# EAGLE schematic ioboard (EAGLE 9.6.2)
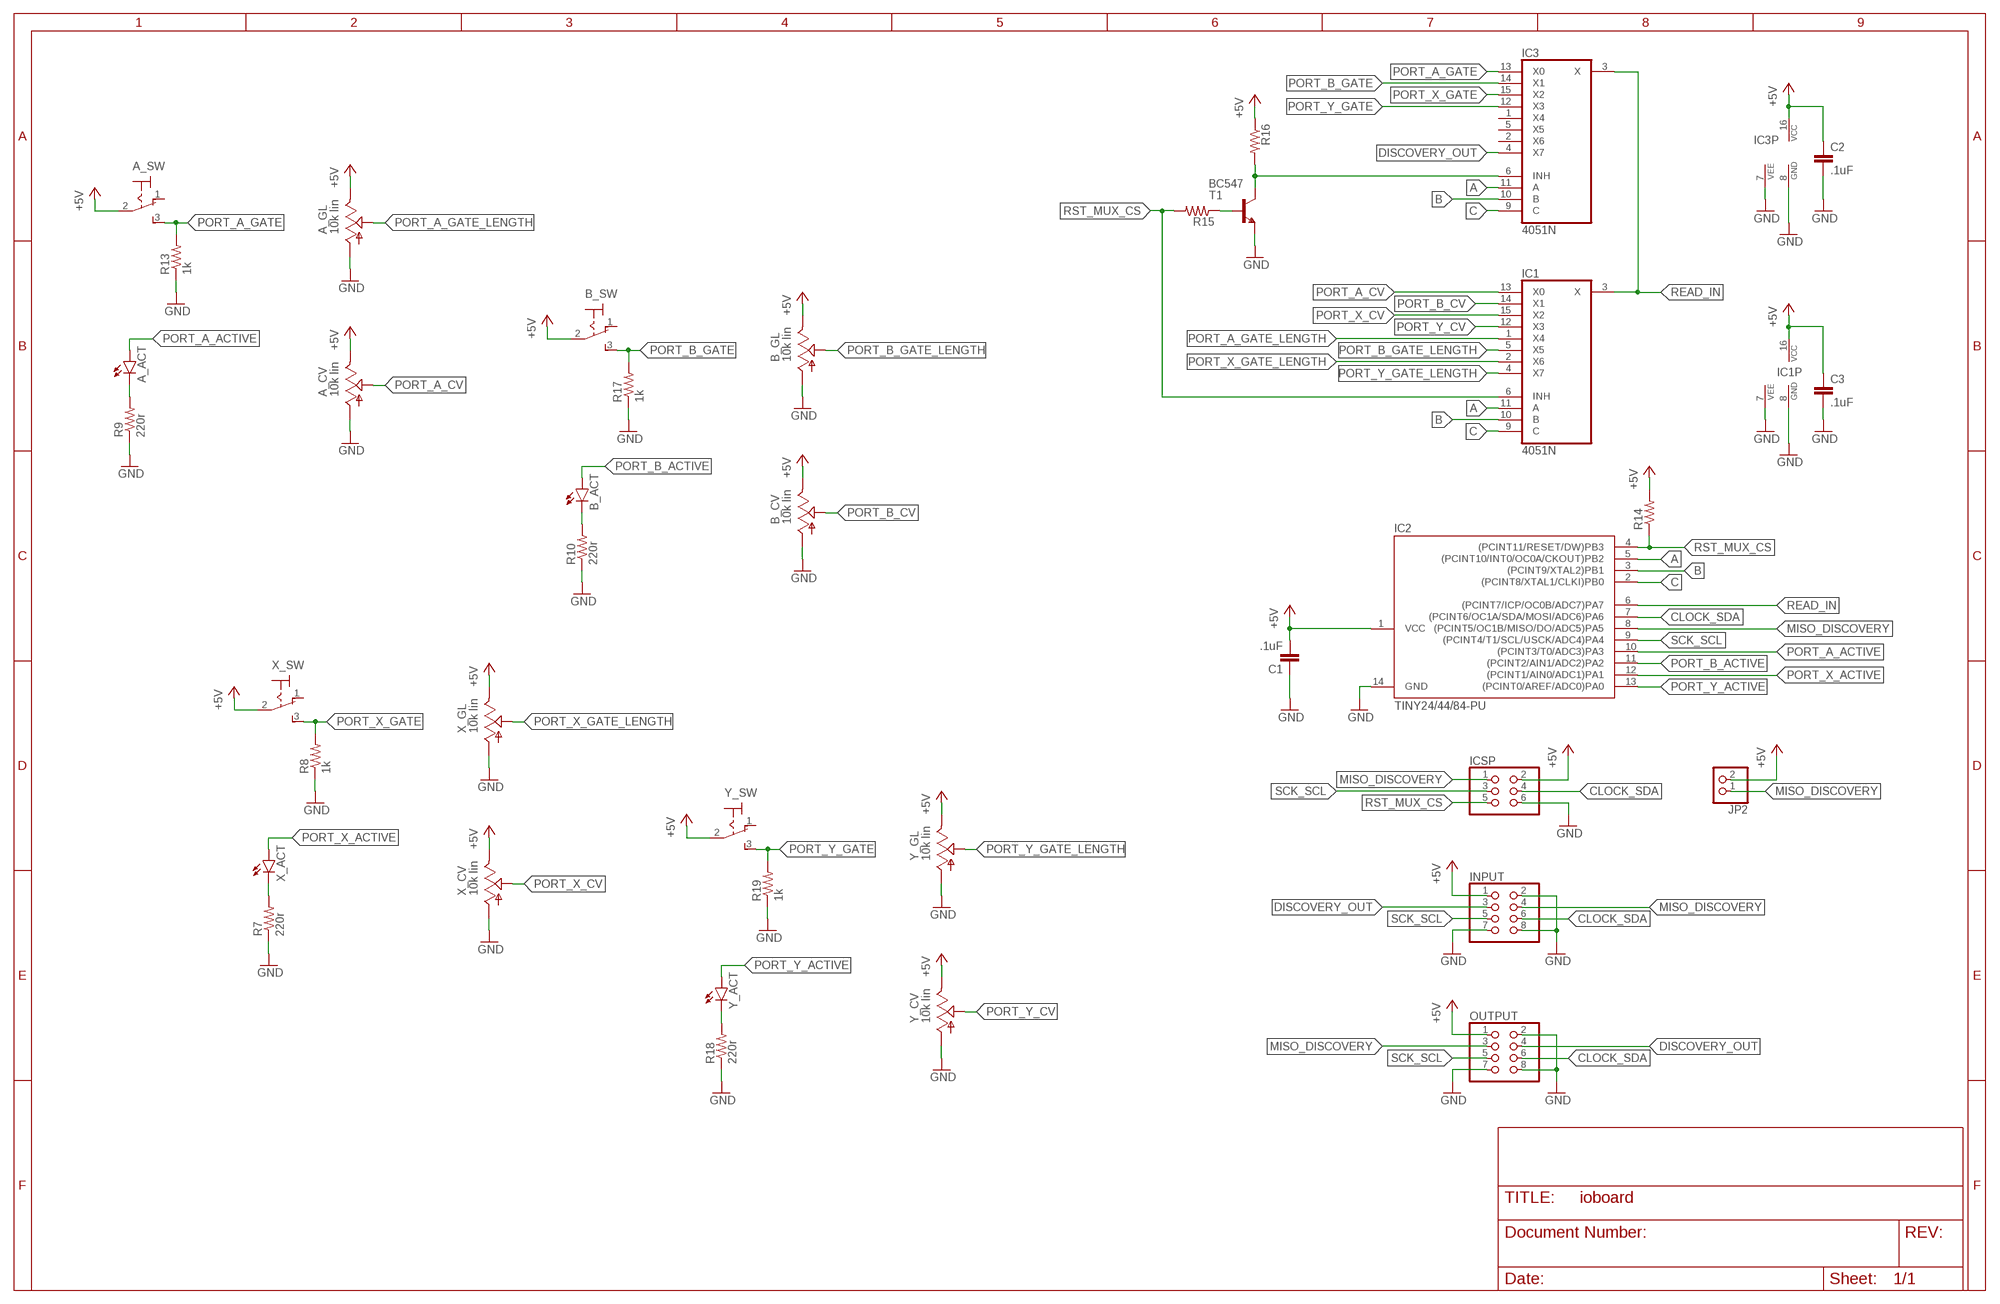
[diagram p0: schematic, sheet 1]

## Parts
A_ACT  LED5MM  [LED5MM]
A_CV  10k lin  ALPHA-9MMA  [EVUF]
A_GL  10k lin  ALPHA-9MMA  [EVUF]
A_SW  M9040P  [M9040P]
B_ACT  LED5MM  [LED5MM]
B_CV  10k lin  ALPHA-9MMA  [EVUF]
B_GL  10k lin  ALPHA-9MMA  [EVUF]
B_SW  M9040P  [M9040P]
C1  .1uF  C-EU050-024X044  [C050-024X044]
C2  .1uF  C-EU050-024X044  [C050-024X044]
C3  .1uF  C-EU050-024X044  [C050-024X044]
IC1  4051N  [DIL16]
IC2  TINY24/44/84-PU  [DIL14]
IC3  4051N  [DIL16]
ICSP  PINHD-2X3  [2X03]
INPUT  PINHD-2X4  [2X04]
JP2  PINHD-1X2  [1X02]
OUTPUT  PINHD-2X4  [2X04]
R7  220r  R-US_0204/7  [0204/7]
R8  1k  R-US_0204/7  [0204/7]
R9  220r  R-US_0204/7  [0204/7]
R10  220r  R-US_0204/7  [0204/7]
R13  1k  R-US_0204/7  [0204/7]
R14  R-US_0204/7  [0204/7]
R15  R-US_0204/7  [0204/7]
R16  R-US_0204/7  [0204/7]
R17  1k  R-US_0204/7  [0204/7]
R18  220r  R-US_0204/7  [0204/7]
R19  1k  R-US_0204/7  [0204/7]
T1  BC547  [TO92]
X_ACT  LED5MM  [LED5MM]
X_CV  10k lin  ALPHA-9MMA  [EVUF]
X_GL  10k lin  ALPHA-9MMA  [EVUF]
X_SW  M9040P  [M9040P]
Y_ACT  LED5MM  [LED5MM]
Y_CV  10k lin  ALPHA-9MMA  [EVUF]
Y_GL  10k lin  ALPHA-9MMA  [EVUF]
Y_SW  M9040P  [M9040P]

## Nets
+5V: A_CV.3(E) A_GL.3(E) A_SW.2(P) B_CV.3(E) B_GL.3(E) B_SW.2(P) C1.2 C2.1 C3.1 IC1.16(VCC) IC2.1(VCC) IC3.16(VCC) ICSP.2 INPUT.1 JP2.2 OUTPUT.1 R14.2 R16.1 X_CV.3(E) X_GL.3(E) X_SW.2(P) Y_CV.3(E) Y_GL.3(E) Y_SW.2(P)
A: IC1.11(A) IC2.5((PCINT10/INT0/OC0A/CKOUT)PB2) IC3.11(A)
B: IC1.10(B) IC2.3((PCINT9/XTAL2)PB1) IC3.10(B)
C: IC1.9(C) IC2.2((PCINT8/XTAL1/CLKI)PB0) IC3.9(C)
CLOCK_SDA: IC2.7((PCINT6/OC1A/SDA/MOSI/ADC6)PA6) ICSP.4 INPUT.6 OUTPUT.6
DISCOVERY_OUT: IC3.4(X7) INPUT.3 OUTPUT.4
GND: A_CV.1(A) A_GL.1(A) B_CV.1(A) B_GL.1(A) C1.1 C2.2 C3.2 IC1.7(VEE) IC1.8(GND) IC2.14(GND) IC3.7(VEE) IC3.8(GND) ICSP.6 INPUT.2 INPUT.7 INPUT.8 OUTPUT.2 OUTPUT.7 OUTPUT.8 R7.1 R8.1 R9.1 R10.1 R13.1 R17.1 R18.1 R19.1 T1.1(E) X_CV.1(A) X_GL.1(A) Y_CV.1(A) Y_GL.1(A)
MISO_DISCOVERY: IC2.8((PCINT5/OC1B/MISO/DO/ADC5)PA5) ICSP.1 INPUT.4 JP2.1 OUTPUT.3
N$1: A_ACT.K(C) R9.2
N$2: B_ACT.K(C) R10.2
N$3: R15.1 T1.2(B)
N$4: R7.2 X_ACT.K(C)
N$5: R18.2 Y_ACT.K(C)
N$7: IC3.6(INH) R16.2 T1.3(C)
PORT_A_ACTIVE: A_ACT.A IC2.10((PCINT3/T0/ADC3)PA3)
PORT_A_CV: A_CV.2(S) IC1.13(X0)
PORT_A_GATE: A_SW.3(S) IC3.13(X0) R13.2
PORT_A_GATE_LENGTH: A_GL.2(S) IC1.1(X4)
PORT_B_ACTIVE: B_ACT.A IC2.11((PCINT2/AIN1/ADC2)PA2)
PORT_B_CV: B_CV.2(S) IC1.14(X1)
PORT_B_GATE: B_SW.3(S) IC3.14(X1) R17.2
PORT_B_GATE_LENGTH: B_GL.2(S) IC1.5(X5)
PORT_X_ACTIVE: IC2.12((PCINT1/AIN0/ADC1)PA1) X_ACT.A
PORT_X_CV: IC1.15(X2) X_CV.2(S)
PORT_X_GATE: IC3.15(X2) R8.2 X_SW.3(S)
PORT_X_GATE_LENGTH: IC1.2(X6) X_GL.2(S)
PORT_Y_ACTIVE: IC2.13((PCINT0/AREF/ADC0)PA0) Y_ACT.A
PORT_Y_CV: IC1.12(X3) Y_CV.2(S)
PORT_Y_GATE: IC3.12(X3) R19.2 Y_SW.3(S)
PORT_Y_GATE_LENGTH: IC1.4(X7) Y_GL.2(S)
READ_IN: IC1.3(X) IC2.6((PCINT7/ICP/OC0B/ADC7)PA7) IC3.3(X)
RST_MUX_CS: IC1.6(INH) IC2.4((PCINT11/RESET/DW)PB3) ICSP.5 R14.1 R15.2
SCK_SCL: IC2.9((PCINT4/T1/SCL/USCK/ADC4)PA4) ICSP.3 INPUT.5 OUTPUT.5
Unconnected: A_SW.1(O) B_SW.1(O) IC3.1(X4) IC3.2(X6) IC3.5(X5) X_SW.1(O) Y_SW.1(O)

## Library data of the parts
A_ACT B_ACT X_ACT Y_ACT = led:LED: LED OSRAM: - CHIPLED LG R971, LG N971, LY N971, LG Q971, LY Q971, LO R971, LY R971 LH N974, LH R974 LS Q976, LO Q976, LY Q976 LO Q996 - Hyper CHIPLED LW Q18S LB Q993, LB Q99A, LB R99A - SideLED LS A670, LO A670, LY A670, LG A670, LP A670 LB A673, LV A673, LT A673, LW A673 LH A674 LY A675 LS A676, LA A676, LO A676, LY A676, LW A676 LS A679, LY A679, LG A679 - Hyper Micro SIDELED® LS Y876, LA Y876, LO Y876, LY Y876 LT Y87S - SmartLED LW L88C, LW L88S LB L89C, LB L89S, LG L890 LS L89K, LO L89K, LY L89K LS L896, LA L896, LO L896, LY L896 - TOPLED LS T670, LO T670, LY T670, LG T670, LP T670 LSG T670, LSP T670, LSY T670, LOP T670, LYG T670 LG T671, LOG T671, LSG T671 LB T673, LV T673, LT T673, LW T673 LH T674 LS T676, LA T676, LO T676, LY T676, LB T676, LH T676, LSB T676, LW T676 LB T67C, LV T67C, LT T67C, LS T67K, LO T67K, LY T67K, LW E67C LS E67B, LA E67B, LO E67B, LY E67B, LB E67C, LV E67C, LT E67C LW T67C LS T679, LY T679, LG T679 LS T770, LO T770, LY T770, LG T770, LP T770 LB T773, LV T773, LT T773, LW T773 LH T774 LS E675, LA E675, LY E675, LS T675 LS T776, LA T776, LO T776, LY T776, LB T776 LHGB T686 LT T68C, LB T68C - Hyper Mini TOPLED® LB M676 - Mini TOPLED Santana® LG M470 LS M47K, LO M47K, LY M47K Source: http://www.osram.convergy.de LUXEON: - LUMILED® LXK2-PW12-R00, LXK2-PW12-S00, LXK2-PW14-U00, LXK2-PW14-V00 LXK2-PM12-R00, LXK2-PM12-S00, LXK2-PM14-U00 LXK2-PE12-Q00, LXK2-PE12-R00, LXK2-PE12-S00, LXK2-PE14-T00, LXK2-PE14-U00 LXK2-PB12-K00, LXK2-PB12-L00, LXK2-PB12-M00, LXK2-PB14-N00, LXK2-PB14-P00, LXK2-PB14-Q00 LXK2-PR12-L00, LXK2-PR12-M00, LXK2-PR14-Q00, LXK2-PR14-R00 LXK2-PD12-Q00, LXK2-PD12-R00, LXK2-PD12-S00 LXK2-PH12-R00, LXK2-PH12-S00 LXK2-PL12-P00, LXK2-PL12-Q00, LXK2-PL12-R00 Source: www.luxeon.com KINGBRIGHT: KA-3528ASYC Source: www.kingbright.com
A_CV A_GL B_CV B_GL X_CV X_GL Y_CV Y_GL = TomW:ALPHA-9MM: 9 mm Square Rotary Potentiometers Source: Panasonic
A_SW B_SW X_SW Y_SW = switch:M9040P: TOGGLE SWITCH Marquardt
C1-C3 = rcl:C-EU: CAPACITOR, European symbol; SPICEPREFIX: C
IC1 IC3 = 40xx:4051: 8-channel ANALOG MULTIPLEXER
IC2 = avr-7:TINY24/44/84
ICSP = pinhead:PINHD-2X3: PIN HEADER
INPUT OUTPUT = pinhead:PINHD-2X4: PIN HEADER
JP2 = pinhead:PINHD-1X2: PIN HEADER
R7-R10 R13-R19 = rcl:R-US_: RESISTOR, American symbol; SPICEPREFIX: R
T1 = transistor:BC547: NPN TRANSISTOR